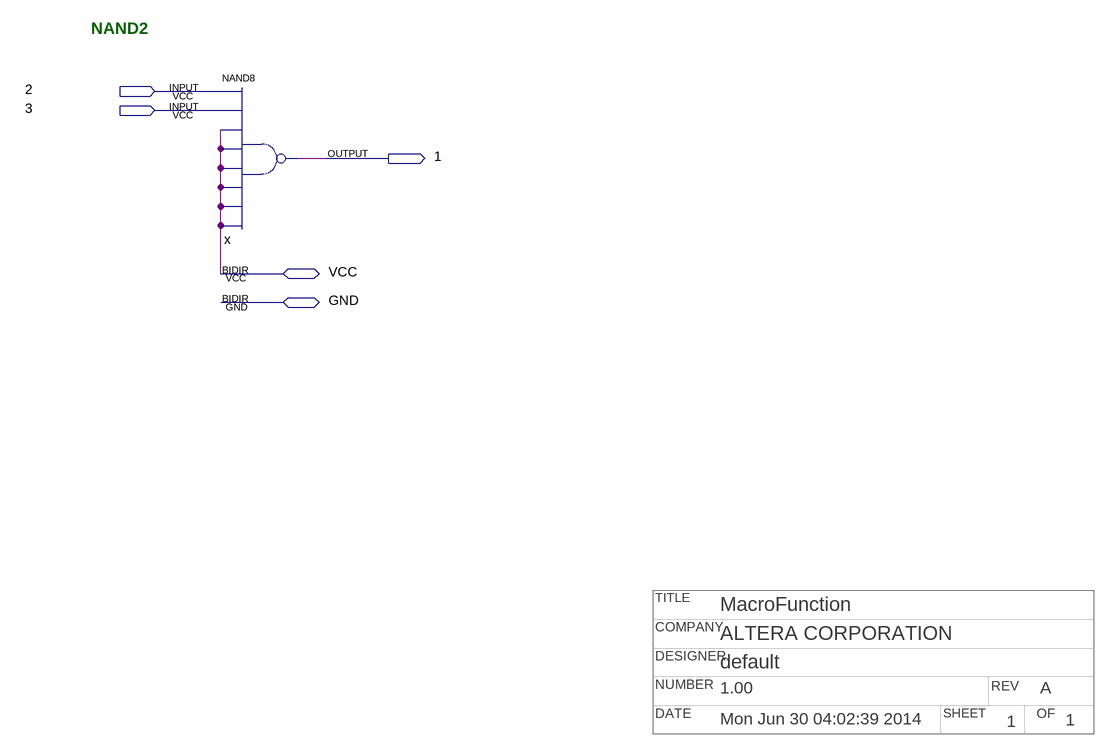
[diagram p0: schematic sheet]
// Quartus schematic npnand2.bdf as structural Verilog: 1 symbols, 5 pins
// Title block: TITLE: MacroFunction; COMPANY: ALTERA CORPORATION; DESIGNER: default; NUMBER: 1.00; REV: A; DATE: Mon Jun 30 04:02:39 2014; SHEET: 1; OF: 1
module npnand2 (
  input  \2 ,
  input  \3 ,
  inout  VCC,
  inout  GND,
  output \1 
);

  nand x (\1 , \2 , \3 , VCC, VCC, VCC, VCC, VCC, VCC);

  // Notes on the sheet:
  //   NAND2
endmodule
